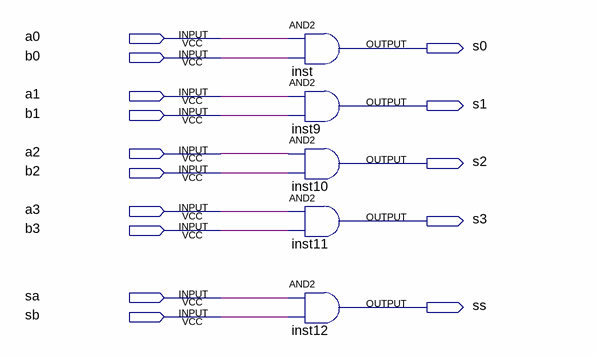
[diagram p0: schematic sheet]
// Quartus schematic and.bdf as structural Verilog: 5 symbols, 15 pins
module \and  (
  input  a0,
  input  b0,
  input  a1,
  input  b1,
  input  a2,
  input  b2,
  input  a3,
  input  b3,
  input  sa,
  input  sb,
  output s0,
  output s1,
  output s2,
  output s3,
  output ss
);

  and inst (s0, a0, b0);
  and inst9 (s1, a1, b1);
  and inst10 (s2, a2, b2);
  and inst11 (s3, a3, b3);
  and inst12 (ss, sa, sb);
endmodule
